# EasyEDA schematic 1-Schematic_syntheseproject_planA.json
TITLE: Plan A; REV: 1.0; Date: 2024-10-12; Sheet: 1/1; Drawn By: stan_goditiabois; Company: HoGent
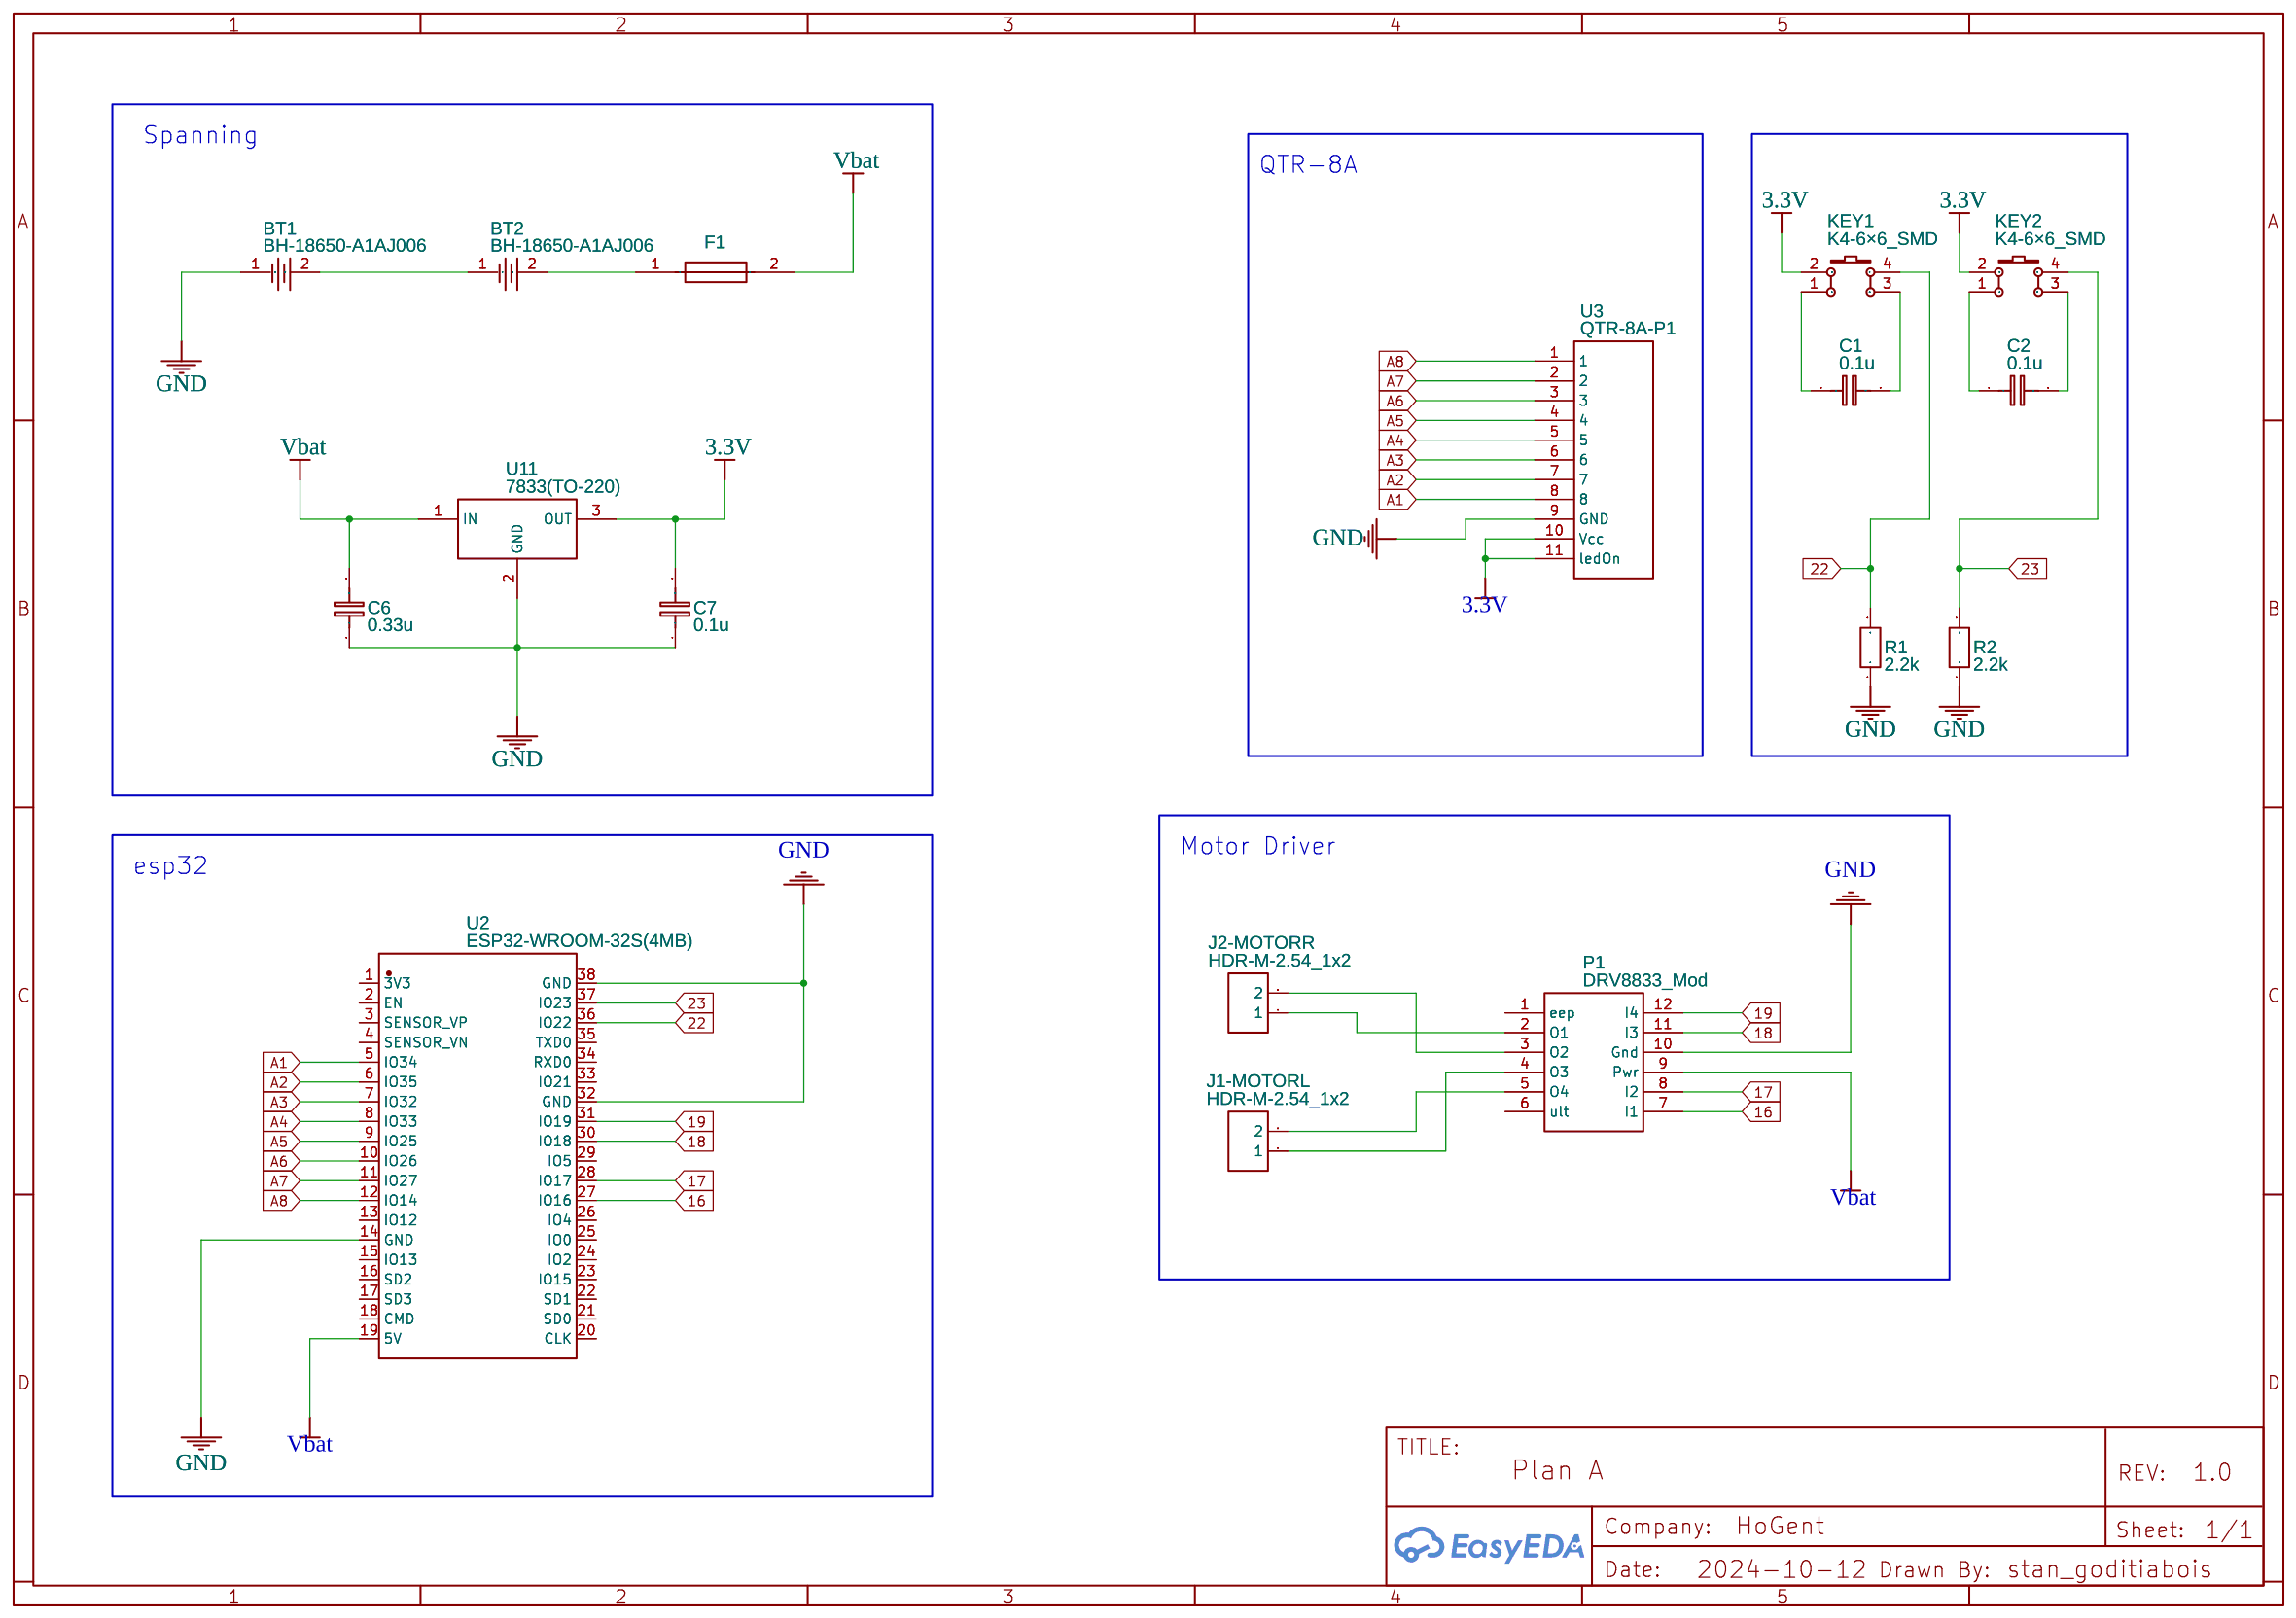
[diagram p0: schematic sheet]

## Parts
BT1  BH-18650-A1AJ006  [BAT-TH_BH-18650-A1AJ006]
BT2  BH-18650-A1AJ006  [BAT-TH_BH-18650-A1AJ006]
C1  0.1u  [C0805]
C2  0.1u  [C0805]
C6  0.33u  [C0805]
C7  0.1u  [C0805]
F1  JK600-150U  [DIP-PTC-15MMX6.5MM]
J1-MOTORL  HDR-M-2.54_1x2  [HDR-M-2.54_1X2]
J2-MOTORR  HDR-M-2.54_1x2  [HDR-M-2.54_1X2]
KEY1  K4-6×6_SMD  [KEY-SMD_4P-L6.0-W6.0-P4.50-LS8.6]
KEY2  K4-6×6_SMD  [KEY-SMD_4P-L6.0-W6.0-P4.50-LS8.6]
P1  DRV8833_Mod  [DRV8833_MOD]
R1  2.2k  [R0805]
R2  2.2k  [R0805]
U2  ESP32-WROOM-32S(4MB)  [COMM-TH_NODEMCU-32SLUA COPY]
U3  QTR-8A-P1  [QTR-8A-P1]
U11  7833(TO-220)  [PG-TO220-3_L10.0-W4.5-P2.54-L]

## Library data of the parts
BT1 BT2 = BH-18650-A1AJ006: Supplier: LCSC; Supplier Part: C5290175; Manufacturer: MYOUNG(美阳); Contributor: lcsc; JLCPCB Part Class: Extended Part
C1 C2 = C_0603_EU: Contributor: LCEDA_Lib
C6 C7 = C_0805_EU: Contributor: LCEDA_Lib
F1 = JK600-150U: Contributor: LCSC; Supplier: LCSC; Manufacturer: Yenji; Supplier Part: C139122
J1-MOTORL J2-MOTORR = HDR-M-2.54_1x2: Supplier Part: C124375; Supplier: LCSC; Contributor: LCEDA_Lib
KEY1 KEY2 = K4-6×6_SMD: Supplier Part: C191626; Supplier: LCSC; Manufacturer: 韩国韩荣; Manufacturer Part: K2-6639SP-D4SC-04; Contributor: LCEDA_Lib
P1 = DRV8833_Mod: Contributor: Frank Cappelle
R1 R2 = R_0805_EU: Contributor: LCEDA_Lib
U2 = ESP32-WROOM-32S(4MB): Supplier: LCSC; Supplier Part: C529580; Manufacturer: Espressif Systems; Contributor: Aaron Hentschel; JLCPCB Part Class: Extended Part
U3 = QTR-8A-P1: Contributor: stan_goditiabois
U11 = 7833(TO-220): Manufacturer: Taitron Components Incorporated; Manufacturer Part: LM7833-TA3-I-T; Contributor: Rebanta2000

## Nets
3.3V: C7.2 KEY1.2 KEY2.2 U3.10(Vcc) U3.11(ledOn) U11.3(OUT)
GND: BT1.1 C6.1 C7.1 P1.10(Gnd) R1.1 R2.1 U2.14(GND) U2.32(GND) U2.38(GND) U3.9(GND) U11.2(GND)
Vbat: C6.2 F1.2 P1.9(Pwr) U2.19(5V) U11.1(IN)
16: P1.7(I1) U2.27(IO16)
17: P1.8(I2) U2.28(IO17)
18: P1.11(I3) U2.30(IO18)
19: P1.12(I4) U2.31(IO19)
22: KEY1.4 R1.2 U2.36(IO22)
23: KEY2.4 R2.2 U2.37(IO23)
A1: U2.5(IO34) U3.8
A2: U2.6(IO35) U3.7
A3: U2.7(IO32) U3.6
A4: U2.8(IO33) U3.5
A5: U2.9(IO25) U3.4
A6: U2.10(IO26) U3.3
A7: U2.11(IO27) U3.2
A8: U2.12(IO14) U3.1
Net-(BT1-2): BT1.2 BT2.1
Net-(BT2-2): BT2.2 F1.1
Net-(C1-1): C1.1 KEY1.1
Net-(C1-2): C1.2 KEY1.3
Net-(C2-1): C2.1 KEY2.1
Net-(C2-2): C2.2 KEY2.3
Net-(J1-MOTORL-1): J1-MOTORL.1 P1.4(O3)
Net-(J1-MOTORL-2): J1-MOTORL.2 P1.5(O4)
Net-(J2-MOTORR-1): J2-MOTORR.1 P1.2(O1)
Net-(J2-MOTORR-2): J2-MOTORR.2 P1.3(O2)

Not connected (* = marked no-connect by the designer): P1 1(eep) 6(ult); U2 1(3V3) 2(EN) 3(SENSOR_VP) 4(SENSOR_VN) 13(IO12) 15(IO13) 16(SD2) 17(SD3) 18(CMD) 20(CLK) 21(SD0) 22(SD1) 23(IO15) 24(IO2) 25(IO0) 26(IO4) 29(IO5) 33(IO21) 34(RXD0) 35(TXD0)

## Notes on the sheet
- Spanning
- QTR-8A
- Motor Driver
- esp32
